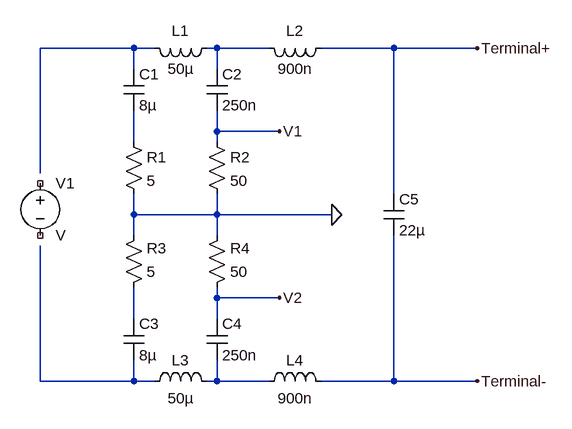
[diagram p0: schematic LISN.asc]
LISN.asc, the LTspice schematic file:
Version 4
SHEET 1 880 680
WIRE 112 80 -32 80
WIRE 144 80 112 80
WIRE 240 80 224 80
WIRE 320 80 240 80
WIRE 512 80 400 80
WIRE 640 80 512 80
WIRE 112 112 112 80
WIRE 240 112 240 80
WIRE 240 208 240 176
WIRE 336 208 240 208
WIRE 112 224 112 176
WIRE 240 224 240 208
WIRE -32 272 -32 80
WIRE 512 304 512 80
WIRE 112 336 112 304
WIRE 240 336 240 304
WIRE 240 336 112 336
WIRE 416 336 240 336
WIRE 112 368 112 336
WIRE 240 368 240 336
WIRE 240 464 240 448
WIRE 336 464 240 464
WIRE 112 496 112 448
WIRE 240 496 240 464
WIRE -32 592 -32 384
WIRE 112 592 112 560
WIRE 112 592 -32 592
WIRE 144 592 112 592
WIRE 240 592 240 560
WIRE 240 592 224 592
WIRE 320 592 240 592
WIRE 512 592 512 368
WIRE 512 592 400 592
WIRE 640 592 512 592
FLAG 336 208 V1
FLAG 416 336 0
FLAG 336 464 V2
FLAG 640 80 Terminal+
FLAG 640 592 Terminal-
SYMBOL cap 96 112 R0
SYMATTR InstName C1
SYMATTR Value 8µ
SYMBOL res 96 208 R0
SYMATTR InstName R1
SYMATTR Value 5
SYMBOL cap 224 112 R0
SYMATTR InstName C2
SYMATTR Value 250n
SYMBOL ind 240 64 R90
WINDOW 0 5 56 VBottom 2
WINDOW 3 32 56 VTop 2
SYMATTR InstName L1
SYMATTR Value 50µ
SYMBOL ind 416 64 R90
WINDOW 0 5 56 VBottom 2
WINDOW 3 32 56 VTop 2
SYMATTR InstName L2
SYMATTR Value 900n
SYMBOL res 224 208 R0
SYMATTR InstName R2
SYMATTR Value 50
SYMBOL cap 96 560 M180
WINDOW 0 24 56 Left 2
WINDOW 3 24 8 Left 2
SYMATTR InstName C3
SYMATTR Value 8µ
SYMBOL res 96 464 M180
WINDOW 0 36 76 Left 2
WINDOW 3 36 40 Left 2
SYMATTR InstName R3
SYMATTR Value 5
SYMBOL cap 224 560 M180
WINDOW 0 24 56 Left 2
WINDOW 3 24 8 Left 2
SYMATTR InstName C4
SYMATTR Value 250n
SYMBOL ind 240 608 M270
WINDOW 0 32 56 VTop 2
WINDOW 3 5 56 VBottom 2
SYMATTR InstName L3
SYMATTR Value 50µ
SYMBOL ind 416 608 M270
WINDOW 0 32 56 VTop 2
WINDOW 3 5 56 VBottom 2
SYMATTR InstName L4
SYMATTR Value 900n
SYMBOL res 224 464 M180
WINDOW 0 36 76 Left 2
WINDOW 3 36 40 Left 2
SYMATTR InstName R4
SYMATTR Value 50
SYMBOL cap 496 304 R0
SYMATTR InstName C5
SYMATTR Value 22µ
SYMBOL voltage -32 272 R0
SYMATTR InstName V1

The netlist it stands for:
* LISN.asc
C1 N001 N003 8µ
R1 N003 0 5
C2 N002 V1 250n
L1 N002 N001 50µ
L2 Terminal+ N002 900n
R2 V1 0 50
C3 N005 N004 8µ
R3 N004 0 5
C4 N006 V2 250n
L3 N006 N005 50µ
L4 Terminal- N006 900n
R4 V2 0 50
C5 Terminal+ Terminal- 22µ
V1 NC_01 NC_02 V
.backanno
.end